# EAGLE design 130809_AriloTX_0_1 (EAGLE 6.4)
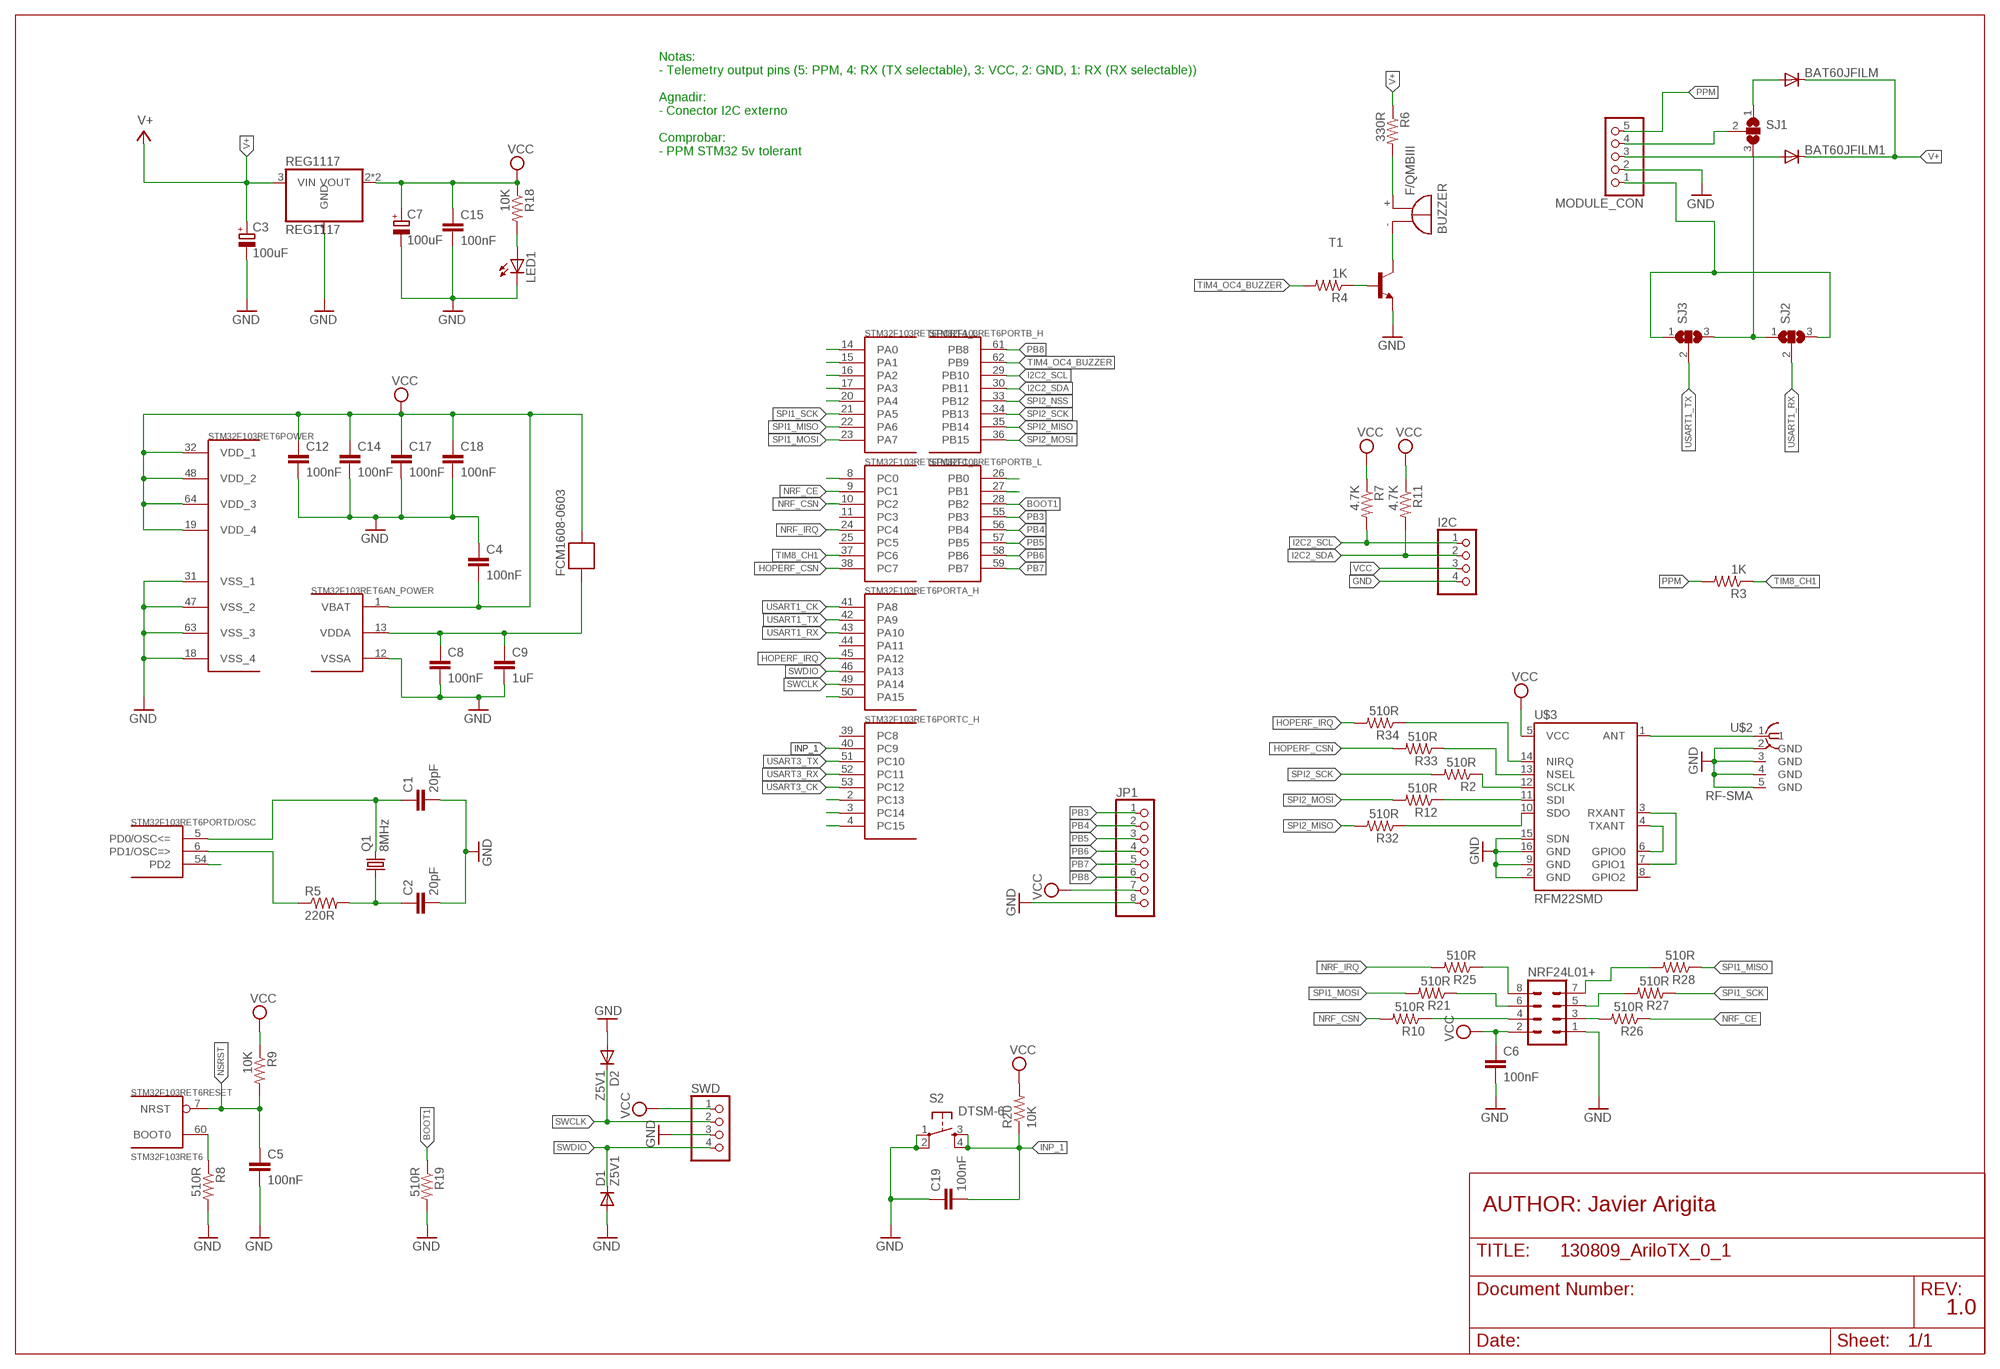
[diagram p0: schematic, sheet 1]

## Parts
BAT60JFILM  DIODE-SOD323-R  [SOD323-R]
BAT60JFILM1  DIODE-SOD323-R  [SOD323-R]
BUZZER  F/QMBIII  [F/QMBIII]
C1  20pF  C-EUC0805  [C0805]
C2  20pF  C-EUC0805  [C0805]
C3  100uF  CPOL-EUSMCB  [SMC_B]
C4  100nF  C-EUC0805  [C0805]
C5  100nF  C-EUC0805  [C0805]
C6  100nF  C-EUC0805  [C0805]
C7  100uF  CPOL-EUSMCB  [SMC_B]
C8  100nF  C-EUC0805  [C0805]
C9  1uF  C-EUC3216  [C3216]
C12  100nF  C-EUC0805  [C0805]
C14  100nF  C-EUC0805  [C0805]
C15  100nF  C-EUC0805  [C0805]
C17  100nF  C-EUC0805  [C0805]
C18  100nF  C-EUC0805  [C0805]
C19  100nF  C-EUC0805  [C0805]
D1  Z5V1  DIODE-SOD323-R  [SOD323-R]
D2  Z5V1  DIODE-SOD323-R  [SOD323-R]
FCM1608-0603  FERRITE-BEAD  [R0603]
I2C  PINHD-1X4  [1X04]
JP1  PINHD-1X8  [1X08]
LED1  LED0805  [CHIPLED_0805]
MODULE_CON  PINHD-1X5  [1X05]
NRF24L01+  MA04-2  [MA04-2]
Q1  8MHz  CRYSTALSM49  [SM49]
R2  510R  RESISTOR0805  [R0805]
R3  1K  RESISTOR0805  [R0805]
R4  1K  RESISTOR0805  [R0805]
R5  220R  RESISTOR0805  [R0805]
R6  330R  RESISTOR0805  [R0805]
R7  4.7K  RESISTOR0805  [R0805]
R8  510R  RESISTOR0805  [R0805]
R9  10K  RESISTOR0805  [R0805]
R10  510R  RESISTOR0805  [R0805]
R11  4.7K  RESISTOR0805  [R0805]
R12  510R  RESISTOR0805  [R0805]
R18  10K  RESISTOR0805  [R0805]
R19  510R  RESISTOR0805  [R0805]
R20  10K  RESISTOR0805  [R0805]
R21  510R  RESISTOR0805  [R0805]
R25  510R  RESISTOR0805  [R0805]
R26  510R  RESISTOR0805  [R0805]
R27  510R  RESISTOR0805  [R0805]
R28  510R  RESISTOR0805  [R0805]
R32  510R  RESISTOR0805  [R0805]
R33  510R  RESISTOR0805  [R0805]
R34  510R  RESISTOR0805  [R0805]
REG1117  REG1117  [SOT223]
S2  DTSM-6  [DTSM-6]
SJ1  SJ2W  [SJ_2]
SJ2  SJ2W  [SJ_2]
SJ3  SJ2W  [SJ_2]
STM32F103RET6  STM32F103RET6  STM32F10XRXT6  [TQFP64]
SWD  PINHD-1X4  [1X04]
T1  BC848-NPN-SOT23-BEC  [SOT23-BEC]
U$2  RF-SMA  [BU-SMA-H]
U$3  RFM22SMD  [RFM22-XXX-S2]

## Nets
BOOT1: R19.1 STM32F103RET6.28(PORTB_L:PB2)
GND: C1.2 C2.2 C3.- C4.1 C5.2 C6.2 C7.- C8.2 C9.2 C12.2 C14.2 C15.2 C17.2 C18.2 C19.1 D1.A D2.A I2C.4 JP1.8 LED1.C MODULE_CON.2 NRF24L01+.1 R8.2 R19.2 REG1117.1(GND) S2.1 S2.2 STM32F103RET6.12(AN_POWER:VSSA) STM32F103RET6.18(POWER:VSS_4) STM32F103RET6.31(POWER:VSS_1) STM32F103RET6.47(POWER:VSS_2) STM32F103RET6.63(POWER:VSS_3) SWD.3 T1.E U$2.2(GND) U$2.3(GND) U$2.4(GND) U$2.5(GND) U$3.2(GND) U$3.9(GND) U$3.15(SDN) U$3.16(GND)
HOPERF_CSN: R33.2 STM32F103RET6.38(PORTC_L:PC7)
HOPERF_IRQ: R34.2 STM32F103RET6.45(PORTA_H:PA12)
I2C2_SCL: I2C.1 R7.2 STM32F103RET6.29(PORTB_H:PB10)
I2C2_SDA: I2C.2 R11.2 STM32F103RET6.30(PORTB_H:PB11)
INP_1: C19.2 R20.1 S2.3 S2.4 STM32F103RET6.40(PORTC_H:PC9)
N$1: C1.1 Q1.2 STM32F103RET6.5(PORTD/OSC:PD0/OSC<=)
N$2: R5.1 STM32F103RET6.6(PORTD/OSC:PD1/OSC=>)
N$3: C2.1 Q1.1 R5.2
N$4: R8.1 STM32F103RET6.60(RESET:BOOT0)
N$5: U$3.3(RXANT) U$3.7(GPIO1)
N$6: U$3.4(TXANT) U$3.6(GPIO0)
N$7: R2.1 U$3.12(SCLK)
N$8: R12.1 U$3.11(SDI)
N$9: MODULE_CON.4 SJ1.2
N$10: LED1.A R18.2
N$11: BAT60JFILM.A SJ1.1
N$12: R32.1 U$3.10(SDO)
N$13: SJ1.3 SJ2.1 SJ3.3
N$14: BAT60JFILM1.A MODULE_CON.3
N$15: MODULE_CON.1 SJ2.3 SJ3.1
N$16: BUZZER.+(-) R6.2
N$17: C8.1 C9.1 FCM1608-0603.2 STM32F103RET6.13(AN_POWER:VDDA)
N$18: NRF24L01+.4 R10.1
N$19: NRF24L01+.3 R26.2
N$20: U$2.1 U$3.1(ANT)
N$21: R4.1 T1.B
N$22: R34.1 U$3.14(NIRQ)
N$23: BUZZER.-(+) T1.C
N$24: R33.1 U$3.13(NSEL)
N$25: STM32F103RET6.14(PORTA_L:PA0)
N$26: STM32F103RET6.15(PORTA_L:PA1)
N$27: STM32F103RET6.16(PORTA_L:PA2)
N$28: STM32F103RET6.17(PORTA_L:PA3)
N$29: STM32F103RET6.20(PORTA_L:PA4)
N$31: STM32F103RET6.8(PORTC_L:PC0)
N$32: STM32F103RET6.26(PORTB_L:PB0)
N$33: STM32F103RET6.27(PORTB_L:PB1)
N$36: NRF24L01+.5 R27.2
N$38: NRF24L01+.6 R21.1
N$39: NRF24L01+.8 R25.1
N$42: NRF24L01+.7 R28.2
N$43: STM32F103RET6.50(PORTA_H:PA15)
N$44: STM32F103RET6.2(PORTC_H:PC13)
N$45: STM32F103RET6.3(PORTC_H:PC14)
N$46: STM32F103RET6.4(PORTC_H:PC15)
N$47: STM32F103RET6.54(PORTD/OSC:PD2)
NRF_CE: R26.1 STM32F103RET6.9(PORTC_L:PC1)
NRF_CSN: R10.2 STM32F103RET6.10(PORTC_L:PC2)
NRF_IRQ: R25.2 STM32F103RET6.24(PORTC_L:PC4)
NSRST: C5.1 R9.2 STM32F103RET6.7(RESET:NRST)
PB3: STM32F103RET6.55(PORTB_L:PB3)
PB4: STM32F103RET6.56(PORTB_L:PB4)
PB5: STM32F103RET6.57(PORTB_L:PB5)
PB6: STM32F103RET6.58(PORTB_L:PB6)
PB7: STM32F103RET6.59(PORTB_L:PB7)
PB8: JP1.6 STM32F103RET6.61(PORTB_H:PB8)
PPM: MODULE_CON.5 R3.2
SPI1_MISO: R28.1 STM32F103RET6.22(PORTA_L:PA6)
SPI1_MOSI: R21.2 STM32F103RET6.23(PORTA_L:PA7)
SPI1_SCK: R27.1 STM32F103RET6.21(PORTA_L:PA5)
SPI2_MISO: R32.2 STM32F103RET6.35(PORTB_H:PB14)
SPI2_MOSI: R12.2 STM32F103RET6.36(PORTB_H:PB15)
SPI2_NSS: STM32F103RET6.33(PORTB_H:PB12)
SPI2_SCK: R2.2 STM32F103RET6.34(PORTB_H:PB13)
SWCLK: D2.C STM32F103RET6.49(PORTA_H:PA14) SWD.2
SWDIO: D1.C STM32F103RET6.46(PORTA_H:PA13) SWD.4
TIM4_OC4_BUZZER: R4.2 STM32F103RET6.62(PORTB_H:PB9)
TIM8_CH1: R3.1 STM32F103RET6.37(PORTC_L:PC6)
USART1_CK: STM32F103RET6.41(PORTA_H:PA8)
USART1_RX: SJ2.2 STM32F103RET6.43(PORTA_H:PA10)
USART1_TX: SJ3.2 STM32F103RET6.42(PORTA_H:PA9)
USART3_CK: STM32F103RET6.53(PORTC_H:PC12)
USART3_RX: STM32F103RET6.52(PORTC_H:PC11)
USART3_TX: STM32F103RET6.51(PORTC_H:PC10)
V+: BAT60JFILM1.C BAT60JFILM.C C3.+ R6.1 REG1117.3(VIN)
VCC: C4.2 C6.1 C7.+ C12.1 C14.1 C15.1 C17.1 C18.1 FCM1608-0603.1 I2C.3 JP1.7 NRF24L01+.2 R7.1 R9.1 R11.1 R18.1 R20.2 REG1117.2(VOUT) REG1117.4(VOUT) STM32F103RET6.1(AN_POWER:VBAT) STM32F103RET6.19(POWER:VDD_4) STM32F103RET6.32(POWER:VDD_1) STM32F103RET6.48(POWER:VDD_2) STM32F103RET6.64(POWER:VDD_3) SWD.1 U$3.5(VCC)
Unconnected: JP1.1 JP1.2 JP1.3 JP1.4 JP1.5 STM32F103RET6.11(PORTC_L:PC3) STM32F103RET6.25(PORTC_L:PC5) STM32F103RET6.39(PORTC_H:PC8) STM32F103RET6.44(PORTA_H:PA11) U$3.8(GPIO2)

## Notes on the sheet
- Notas:
  - Telemetry output pins (5: PPM, 4: RX (TX selectable), 3: VCC, 2: GND, 1: RX (RX selectable))
  
  Agnadir:
  - Conector I2C externo
  
  Comprobar:
  - PPM STM32 5v tolerant
- AUTHOR: Javier Arigita
- 1.0

## Library data of the parts
BAT60JFILM BAT60JFILM1 D1 D2 = diode:DIODE-: DIODE
BUZZER = buzzer:F/QMBIII: BUZZER Source: Buerklin; OC_FARNELL: unknown; OC_NEWARK: unknown
C1 C2 C4-C6 C8 C12 C14 C15 C17-C19 = rcl:C-EU: CAPACITOR, European symbol
C3 C7 = rcl:CPOL-EU: POLARIZED CAPACITOR, European symbol
C9 = resistor:C-EU: CAPACITOR, European symbol
FCM1608-0603 = BaseApp:FERRITE-BEAD
I2C SWD = pinhead:PINHD-1X4: PIN HEADER
JP1 = pinhead:PINHD-1X8: PIN HEADER
LED1 = CEDT:LED
MODULE_CON = pinhead:PINHD-1X5: PIN HEADER
NRF24L01+ = con-lstb:MA04-2: PIN HEADER; OC_FARNELL: unknown; OC_NEWARK: unknown
Q1 = crystal:CRYSTAL: CRYSTAL; OC_FARNELL: unknown; OC_NEWARK: unknown
R2-R12 R18-R21 R25-R28 R32-R34 = CEDT:RESISTOR
REG1117 = CEDT:REG1117: 800mA and 1A Low Dropout (LDO) Positive Regulator 1.8V, 2.5V, 2.85V, 3.3V, 5V, and Adj
S2 = switch-tact:DTSM-6
SJ1-SJ3 = jumper:SJ2W: SMD solder JUMPER
STM32F103RET6 = stm32:STM32F10XRXT6: STM32F101/103 64pin LQFP
T1 = transistor:*-NPN-: NPN Transistror BF959 corrected 2008.03.06
U$2 = BaseApp:RF-SMA
U$3 = SparkFun-RF:RFM22: The RFM22 is a low-power, low cost radio that is capable of operating in the 434MHz and 900MHz open bands. It's frequency is software defined and there are some very good libraries written for it.

## Board
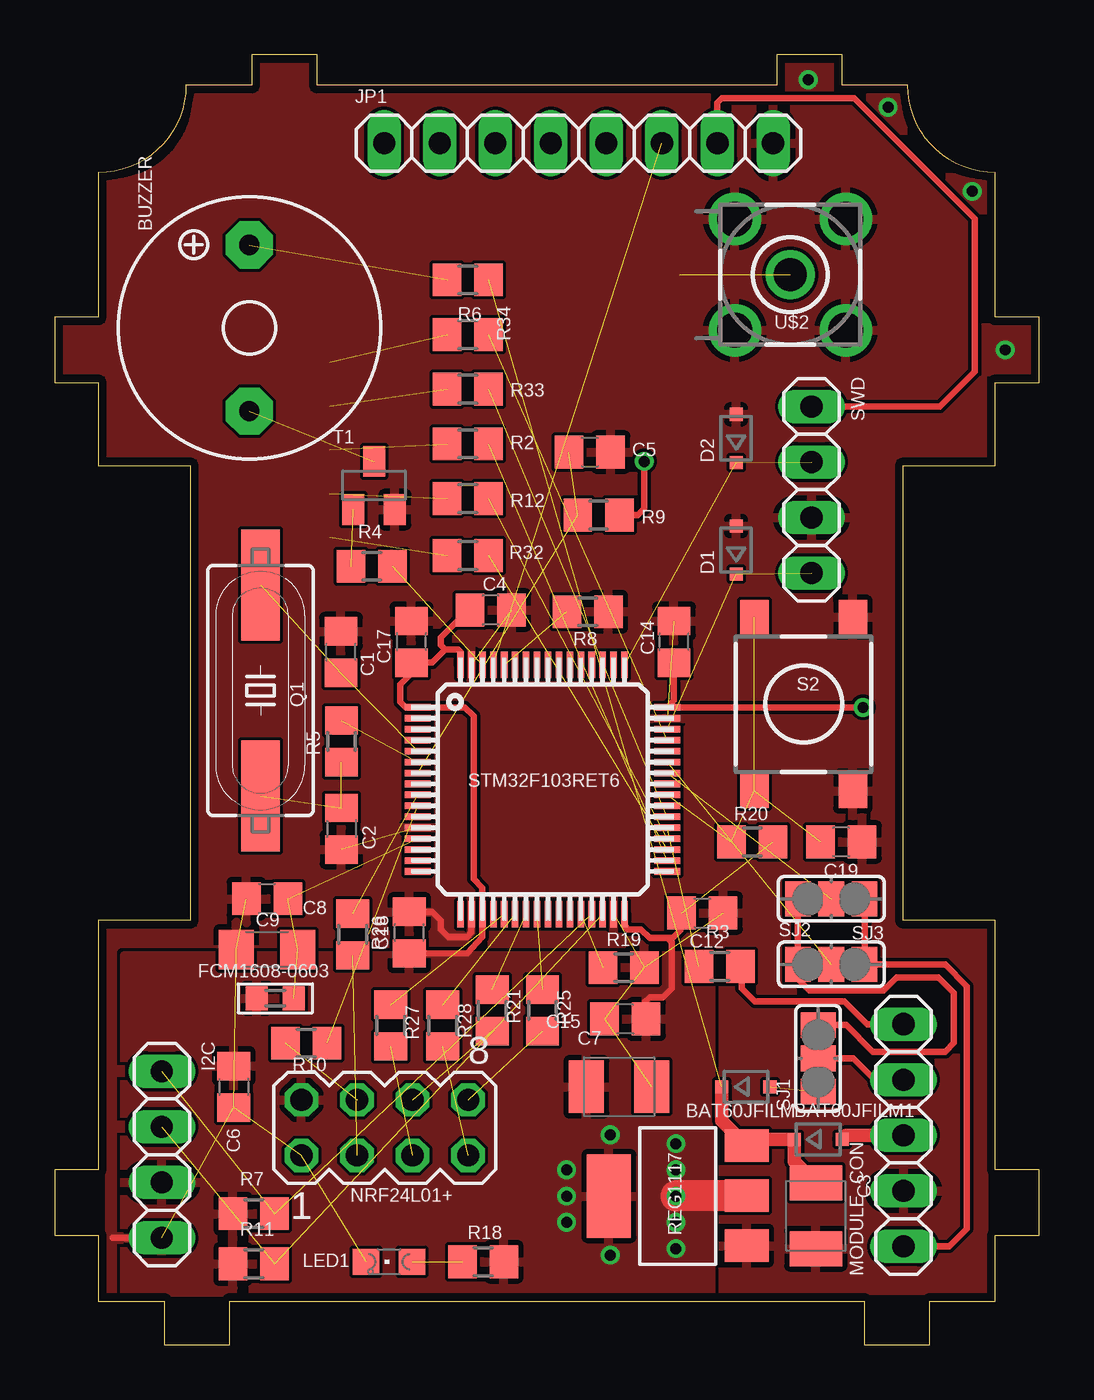
[diagram p1: board, top side]
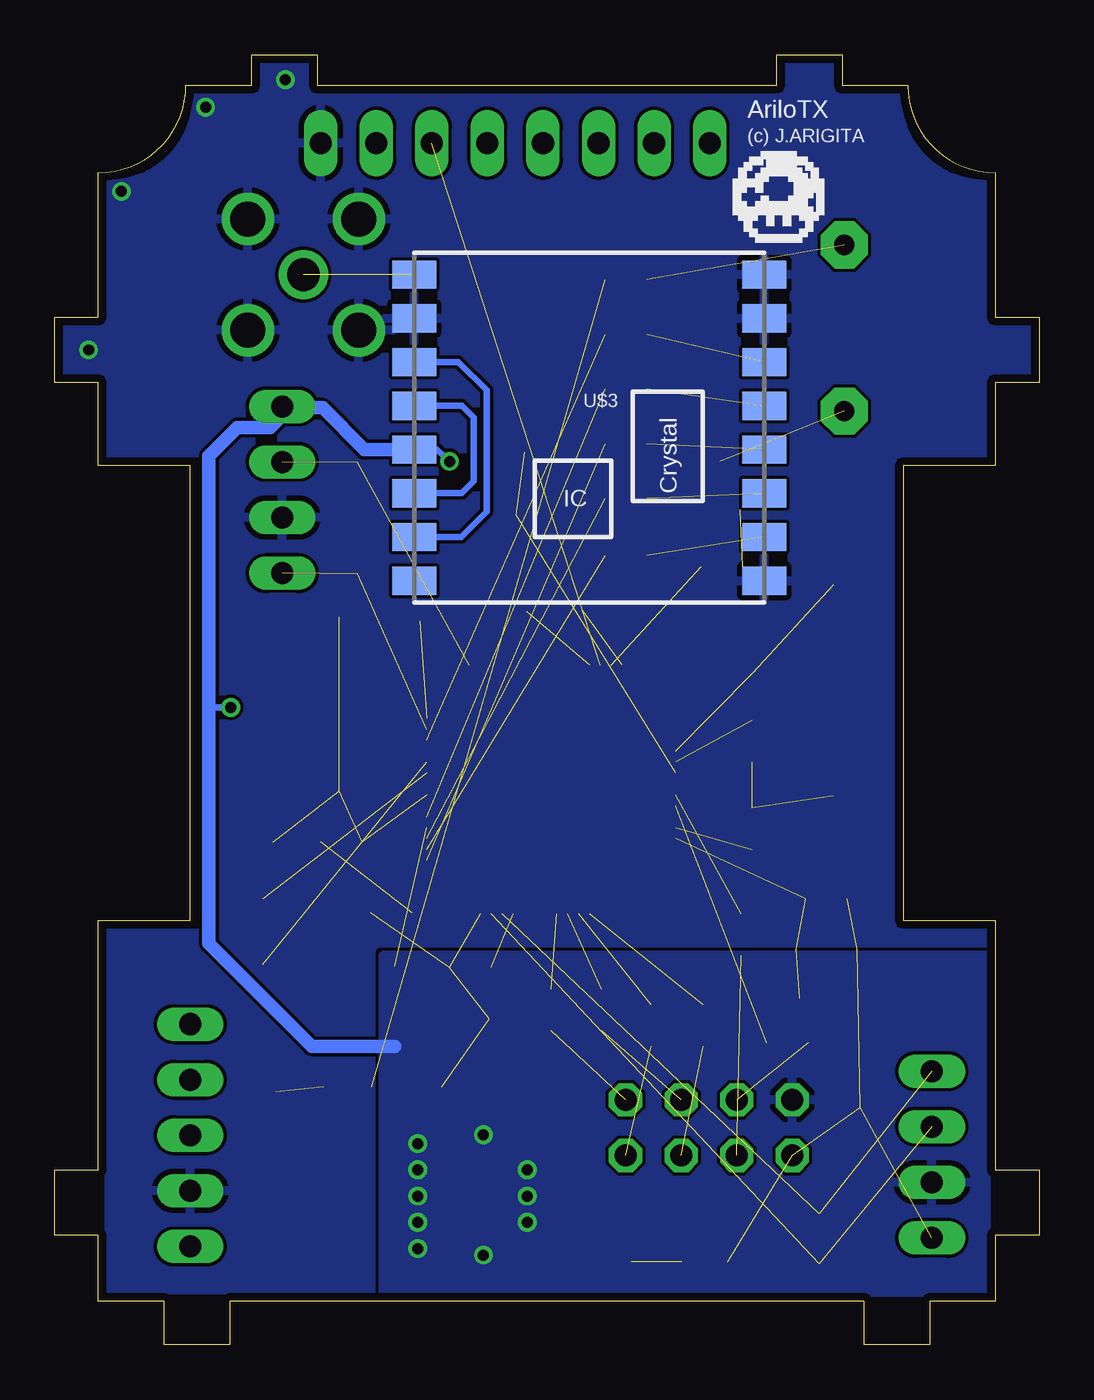
[diagram p2: board, bottom side, seen from below]

Size 45 x 59 mm. Coordinates in mm from the lower left corner, seen from the top.
Outline: 2,2 5,2 5,0 8,0 8,2 37,2 37,0 40,0 40,2 43,2 43,5 45,5 45,8 43,8 43,19.4 38.8,19.4 38.8,40.2 43,40.2 43,44 45,44 45,47 43,47 43,53.6 arc-90 39,57.6 36,57.6 36,59 33,59 33,57.6 12,57.6 12,59 9,59 9,57.6 6,57.6 arc-90 2,53.6 2,47 0,47 0,44 2,44 2,40.2 6.2,40.2 6.2,19.4 2,19.4 2,8 0,8 0,5 2,5 2,2
Copper layers (1*16): Top 0.0356mm / dielectric 1.5011mm / Bottom 0.0356mm
Design rules: minimum track width 6mil, minimum drill 13mil, track to track 6mil, track to pad 6mil, pad to pad 6mil, via to via 6mil, smd to smd 6mil, copper to edge 15mil, drill to drill 6mil, minimum pad ring 7mil, minimum via ring 7mil, stop-mask expansion 4mil, vias tented up to drill 0mil, thermal gap 10mil

### Footprints (pad centres in the part's own frame; a part is rotated, then mirrored left to right if it is on the bottom)
SOD323-R = smd 0.6 x 0.6: A 1.1,0; C -1.1,0
F/QMBIII = drill 0.914 pad 2.159 octagon: + 3.8,0; - -3.8,0
C0805 = smd 1.3 x 1.5: 1 -0.95,0; 2 0.95,0
SMC_B = smd 1.6 x 2.4: + -1.5,0; - 1.5,0
C3216 = smd 1.6 x 1.8: 1 -1.4,0; 2 1.4,0
R0603 = smd 1 x 1.1: 1 -0.85,0; 2 0.85,0
1X04 = drill 1.016 long: 1 -3.81,0; 2 -1.27,0; 3 1.27,0; 4 3.81,0
1X08 = drill 1.016 long: 1 -8.89,0; 2 -6.35,0; 3 -3.81,0; 4 -1.27,0; 5 1.27,0; 6 3.81,0; 7 6.35,0; 8 8.89,0
CHIPLED_0805 = smd 1.2 x 1.2: A 0,-1.05; C 0,1.05
1X05 = drill 1.016 long: 1 -5.08,0; 2 -2.54,0; 3 0,0; 4 2.54,0; 5 5.08,0
MA04-2 = drill 1.016 octagon: 1 -3.81,-1.27; 2 -3.81,1.27; 3 -1.27,-1.27; 4 -1.27,1.27; 5 1.27,-1.27; 6 1.27,1.27; 7 3.81,-1.27; 8 3.81,1.27
SM49 = smd 5.08 x 1.778: 1 -4.826,0; 2 4.826,0
R0805 = smd 1.3 x 1.5: 1 -0.95,0; 2 0.95,0
SOT223 = smd 1.499 x 2.007: 1 -2.261,-3.15; 2 0.025,-3.15; 3 2.311,-3.15 | smd 3.81 x 2.007: 4 0,3.15
DTSM-6 = smd 1.55 x 1.3: 1 -3.975,2.25; 2 3.975,2.25; 3 -3.975,-2.25; 4 3.975,-2.25
SJ_2 = smd 1.168 x 1.6: 1 -1.524,0; 2 0,0; 3 1.524,0
TQFP64 = smd 1.2 x 0.3: 1 -5.7,3.75; 2 -5.7,3.25; 3 -5.7,2.75; 4 -5.7,2.25; 5 -5.7,1.75; 6 -5.7,1.25; 7 -5.7,0.75; 8 -5.7,0.25; 9 -5.7,-0.25; 10 -5.7,-0.75; 11 -5.7,-1.25; 12 -5.7,-1.75; 13 -5.7,-2.25; 14 -5.7,-2.75; 15 -5.7,-3.25; 16 -5.7,-3.75; 33 5.7,-3.75; 34 5.7,-3.25; 35 5.7,-2.75; 36 5.7,-2.25; 37 5.7,-1.75; 38 5.7,-1.25; 39 5.7,-0.75; 40 5.7,-0.25; 41 5.7,0.25; 42 5.7,0.75; 43 5.7,1.25; 44 5.7,1.75; 45 5.7,2.25; 46 5.7,2.75; 47 5.7,3.25; 48 5.7,3.75 | smd 0.3 x 1.2: 17 -3.75,-5.7; 18 -3.25,-5.7; 19 -2.75,-5.7; 20 -2.25,-5.7; 21 -1.75,-5.7; 22 -1.25,-5.7; 23 -0.75,-5.7; 24 -0.25,-5.7; 25 0.25,-5.7; 26 0.75,-5.7; 27 1.25,-5.7; 28 1.75,-5.7; 29 2.25,-5.7; 30 2.75,-5.7; 31 3.25,-5.7; 32 3.75,-5.7; 49 3.75,5.7; 50 3.25,5.7; 51 2.75,5.7; 52 2.25,5.7; 53 1.75,5.7; 54 1.25,5.7; 55 0.75,5.7; 56 0.25,5.7; 57 -0.25,5.7; 58 -0.75,5.7; 59 -1.25,5.7; 60 -1.75,5.7; 61 -2.25,5.7; 62 -2.75,5.7; 63 -3.25,5.7; 64 -3.75,5.7
SOT23-BEC = smd 1 x 1.4: B -0.95,-1.1; C 0,1.1; E 0.95,-1.1
BU-SMA-H = drill 1.5: 1 0,0 | drill 1.6: 2 -2.54,2.54; 3 2.54,2.54; 4 2.54,-2.54; 5 -2.54,-2.54
RFM22-XXX-S2 = smd 2 x 1.3: 1 -8,7; 2 -8,5; 3 -8,3; 4 -8,1; 5 -8,-1; 6 -8,-3; 7 -8,-5; 8 -8,-7; 9 8,-7; 10 8,-5; 11 8,-3; 12 8,-1; 13 8,1; 14 8,3; 15 8,5; 16 8,7

### Placement (x,y rotation side)
BAT60JFILM  31.6,11.8 0 top
BAT60JFILM1  34.9,9.4 0 top
BUZZER  8.9,46.5 90 top
C1  13.09,31.68 90 top
C2  13.11,23.6 270 top
C3  34.8,5.9 270 top
C4  19.93,33.6 180 top
C5  24.46,40.83 0 top
C6  8.18,11.8 270 top
C7  25.8,11.8 0 top
C8  9.71,20.4 180 top
C9  9.71,18.07 180 top
C12  29.61,19.75 0 top
C14  28.31,32.15 90 top
C15  26.09,14.9 180 top
C17  16.31,32.15 90 top
C18  16.21,18.85 90 top
C19  35.96,23 180 top
D1  31.15,36.34 90 top
D2  31.15,41.45 90 top
FCM1608-0603  10.09,15.85 0 top
I2C  4.9,8.7 270 top
JP1  23.95,54.95 0 top
LED1  15.29,3.8 90 top
MODULE_CON  38.81,9.58 90 top
NRF24L01+  15.09,9.93 0 top
Q1  9.41,29.93 90 top
R2  18.89,41.2 0 top
R3  30.4,17.3 0 top
R4  14.5,35.6 0 top
R5  13.11,27.6 270 top
R6  18.89,48.7 180 top
R7  9.1,6 0 top
R8  24.36,33.52 0 top
R9  24.86,37.95 180 top
R10  11.5,13.8 0 top
R11  9.1,3.7 0 top
R12  18.89,38.7 0 top
R18  19.59,3.8 180 top
R19  26.01,17.25 0 top
R20  31.89,23 0 top
R21  20,15.3 90 top
R25  22.3,15.3 90 top
R26  13.62,18.76 270 top
R27  15.36,14.6 270 top
R28  17.73,14.6 270 top
R32  18.89,36.1 0 top
R33  18.89,43.7 0 top
R34  18.89,46.2 0 top
REG1117  28.48,6.8 90 top
S2  34.23,29.3 270 top
SJ1  34.9,13.1 90 top
SJ2  35.5,17.4 0 top
SJ3  35.5,20.4 180 top
STM32F103RET6  22.3,25.4 0 top
SWD  34.6,39.1 270 top
T1  14.6,39.3 0 top
U$2  33.63,48.94 180 top
U$3  20.57,41.94 0 bottom

### Tracks (layer width: path | path; a pad name or v marks a point on that pad's centre or on a via)
BOOT1  (1 unrouted)
GND  (via drill 0.5)  (12 unrouted)
  Top 0.305: STM32F103RET6.18 19.05,18.85 18.85,18.65 18,18.65 17.65,19 17.65,19.4 17.25,19.8 C18.2 | I2C.4 2.66,4.89 2.65,4.9
  other vias: 43.45,45.5 34.45,57.85 38.1,56.6 41.95,52.75
  pour Top (rank 2): 42.5,18.9 38.3,19 38.3,40.7 42.5,40.7 42.5,44.5 44.5,44.5 44.5,46.5 42.5,46.5 42.5,53.1 arc-90 38.5,57.1 35.5,57.1 35.5,58.5 33.5,58.5 33.5,57.1 11.5,57.1 11.5,58.5 9.5,58.5 9.5,57.1 6.5,57.1 arc-90 2.5,53.1 2.5,46.5 0.5,46.5 0.5,44.5 2.5,44.5 2.5,40.7 6.7,40.7 6.7,18.9 2.5,18.9 2.5,2.5 42.5,2.5
  pour Bottom (rank 2): 42.5,18.9 38.3,19 38.3,40.7 42.5,40.7 42.5,44.5 44.5,44.5 44.5,46.5 42.5,46.5 42.5,53.1 arc-90 38.5,57.1 35.5,57.1 35.5,58.5 33.5,58.5 33.5,57.1 11.5,57.1 11.5,58.5 9.5,58.5 9.5,57.1 6.5,57.1 arc-90 2.5,53.1 2.5,46.5 0.5,46.5 0.5,44.5 2.5,44.5 2.5,40.7 6.7,40.7 6.7,18.9 2.5,18.9 2.5,2.5 42.5,2.5
HOPERF_CSN  (1 unrouted)
HOPERF_IRQ  (1 unrouted)
I2C2_SCL  (2 unrouted)
I2C2_SDA  (2 unrouted)
INP_1  (4 unrouted)
N$1  (2 unrouted)
N$2  (1 unrouted)
N$3  (2 unrouted)
N$4  (1 unrouted)
N$5
  Bottom 0.305: U$3.7 26.41,36.94 25.25,38.1 25.25,43.65 26.55,44.95 28.55,44.95 U$3.3
N$6
  Bottom 0.305: U$3.6 28.51,38.94 28.5,38.95 26.4,38.95 25.85,39.5 25.85,42.4 26.4,42.95 28.55,42.95 U$3.4
N$7  (1 unrouted)
N$8  (1 unrouted)
N$9
  Top 0.305: MODULE_CON.4 37.48,12.12 36.5,13.1 SJ1.2
N$10  (1 unrouted)
N$11  (1 unrouted)
N$12  (1 unrouted)
N$13
  Top 0.305: SJ3.3 SJ2.1 34,17.48 34,16.7 34.5,16.2 37.9,16.2 38.5,16.8 40.4,16.8 41.1,16.1 41.1,13.8 40.7,13.4 37.4,13.4 36.18,14.62 SJ1.3
N$14
  Top 0.61: MODULE_CON.3 36.18,9.58 BAT60JFILM1.A
N$15
  Top 0.305: MODULE_CON.1 40.9,4.5 41.7,5.3 41.7,16.4 40.7,17.4 SJ2.3 SJ3.1
N$16  (1 unrouted)
N$17  (3 unrouted)
N$18  (1 unrouted)
N$19  (1 unrouted)
N$20  (1 unrouted)
N$21  (1 unrouted)
N$22  (1 unrouted)
N$23  (1 unrouted)
N$24  (1 unrouted)
N$36  (1 unrouted)
N$38  (1 unrouted)
N$39  (1 unrouted)
N$42  (1 unrouted)
NRF_CE  (1 unrouted)
NRF_CSN  (1 unrouted)
NRF_IRQ  (1 unrouted)
NSRST  (2 unrouted)
PB8  (1 unrouted)
PPM
  Top 0.305: MODULE_CON.5 37.14,14.66 36.1,15.7 32,15.7 31.4,16.3 31.4,17.25 R3.2
SPI1_MISO  (1 unrouted)
SPI1_MOSI  (1 unrouted)
SPI1_SCK  (1 unrouted)
SPI2_MISO  (1 unrouted)
SPI2_MOSI  (1 unrouted)
SPI2_SCK  (1 unrouted)
SWCLK  (2 unrouted)
SWDIO  (2 unrouted)
TIM4_OC4_BUZZER  (1 unrouted)
TIM8_CH1  (1 unrouted)
USART1_RX  (1 unrouted)
USART1_TX  (1 unrouted)
V+  (1 unrouted)
  Top 0.61: C3.+ 33.8,8.4 BAT60JFILM1.C 31.92,9.4 REG1117.3 30.5,10.25 BAT60JFILM.C
VCC  (via drill 0.5)  (1 unrouted)
  Top 0.305: C15.1 27.04,15.06 27,15.1 | 27,15.1 27,14.9 | 27,15.1 27,15.7 27.2,15.9 27.8,15.9 28.2,16.3 28.2,18.4 28,18.6 | 28,18.6 27.2,18.6 26.8,19 26.2,19 26.05,19.15 STM32F103RET6.32 | 28,18.6 28.25,18.6 28.6,18.95 28.6,19.69 C12.1 | C18.1 18.85,17.9 19.55,18.65 STM32F103RET6.19 19.55,20.9 19.15,21.3 19.15,28.75 18.75,29.15 STM32F103RET6.1 16.3,29.15 16.05,29.15 15.8,29.4 15.8,30.2 16.31,30.71 C17.1 17.25,31.2 17.85,31.8 | 17.85,31.8 18.45,31.8 18.55,31.7 STM32F103RET6.64 | C4.2 18.9,33.6 17.65,32.35 17.65,32 17.85,31.8 | SWD.1 40.46,42.91 42.05,44.5 42.05,51.5 36.55,57 30.5,57 30.3,56.8 JP1.7 | v36.95,29.15 STM32F103RET6.48 28.31,29.46 C14.1 | v26.95,40.4 26.95,38.25 26.65,37.95 R9.1
  Top 1.422: REG1117.2 28.43,6.83 v28.4,6.8
  Bottom 0.305: U$3.5 27.54,40.94 v26.95,40.4 | v36.95,29.15 37.85,29.15 37.95,29.25
  Bottom 0.61: 29.45,13.65 33.25,13.65 37.95,18.35 37.95,29.25 37.95,40.65 36.65,41.95 35.15,41.95 34.6,42.5 SWD.1 34.54,42.85 32.75,42.85 30.84,40.94 U$3.5
  other vias: 25.4,9.6 23.4,8 23.4,6.8 23.4,5.6 25.4,4.1 28.4,4.4 28.4,5.6 28.4,8 28.4,9.2
  pour Bottom: 30,2.4 2.4,2.4 2.4,17.8 30,17.8
  pour Bottom: 30,2.4 3.2,2.4 3.2,17.8 30,17.8
  pour Top: 30,2.4 3.2,2.4 3.2,17.8 30,17.8

### Text on the board
bPlace: AriloTX | (c) J.ARIGITA